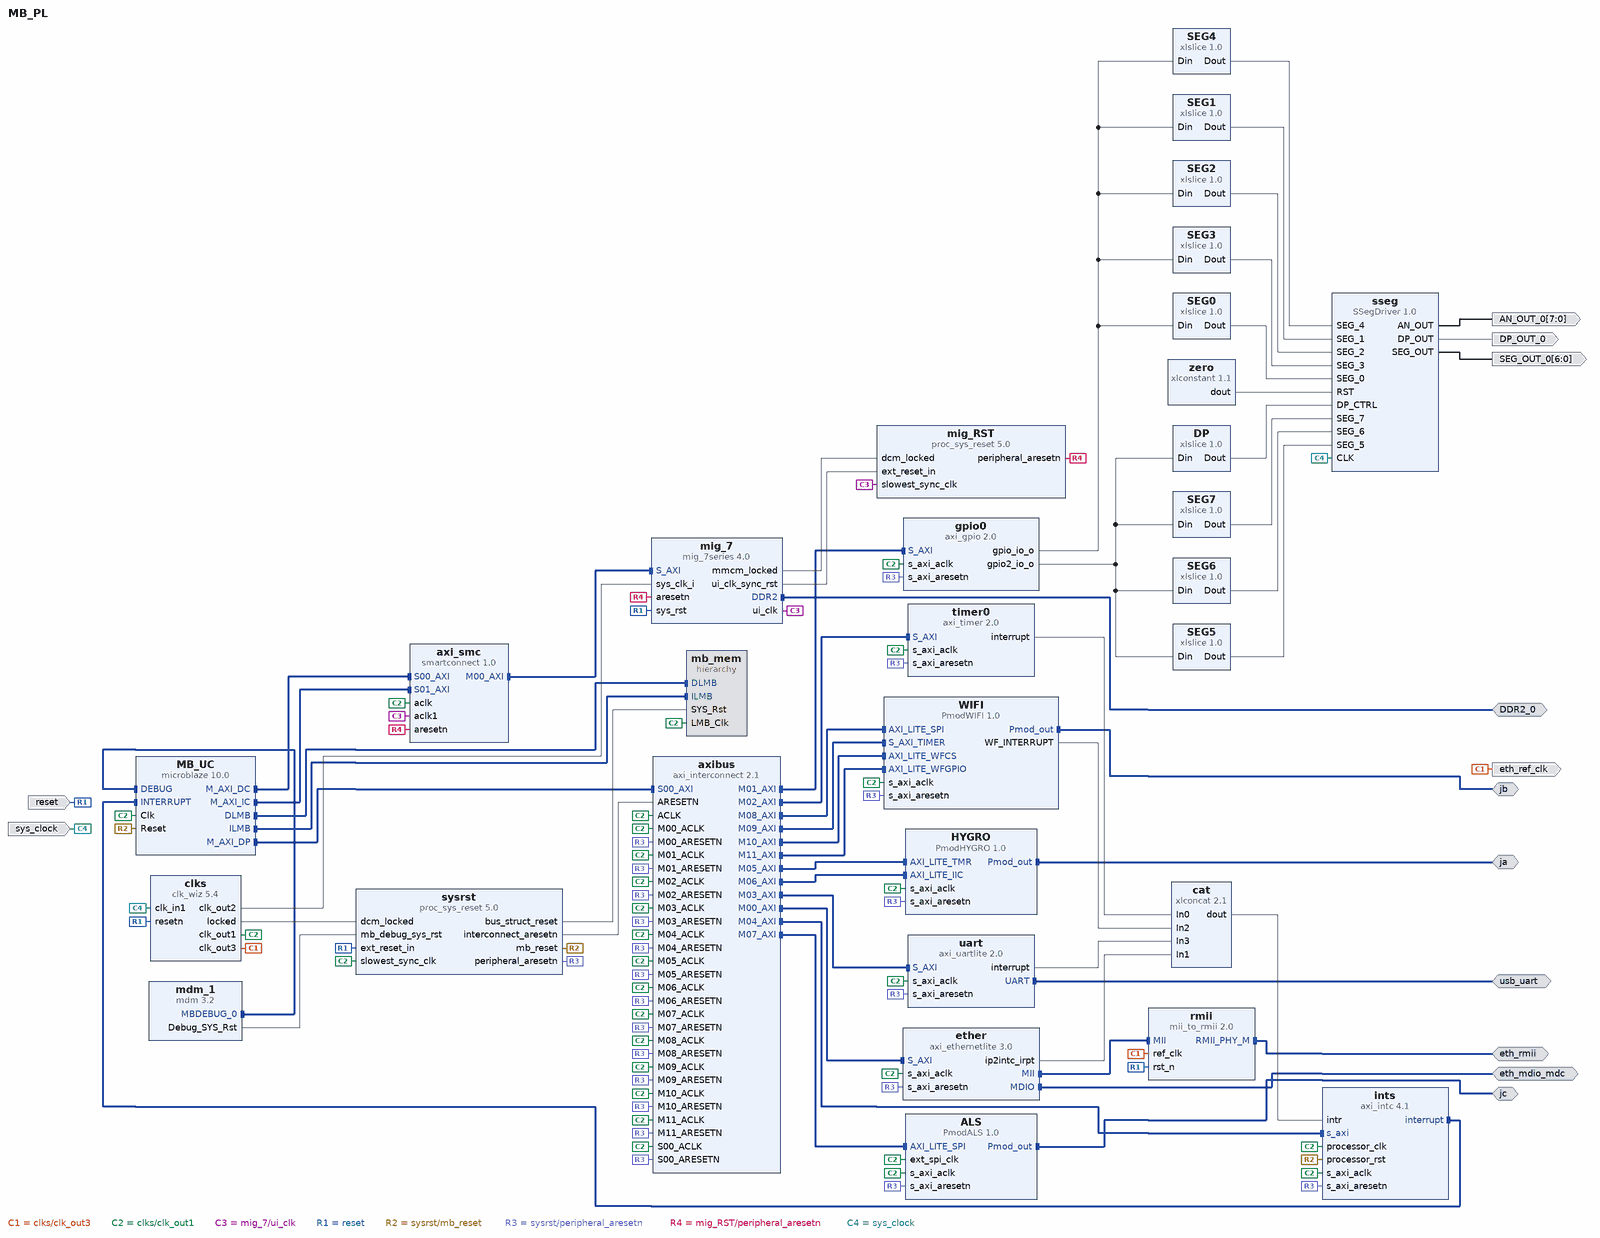
[diagram p0: block diagram of the top level]
# Vivado block design MB_PL, xc7a100tcsg324-1, Vivado 2017.4
create_bd_design MB_PL

create_bd_intf_port -mode Master -vlnv xilinx.com:interface:mdio_rtl:1.0 eth_mdio_mdc
create_bd_intf_port -mode Master -vlnv xilinx.com:interface:rmii_rtl:1.0 eth_rmii
create_bd_intf_port -mode Master -vlnv xilinx.com:interface:uart_rtl:1.0 usb_uart
create_bd_intf_port -mode Master -vlnv xilinx.com:interface:ddrx_rtl:1.0 DDR2_0
create_bd_intf_port -mode Master -vlnv digilentinc.com:interface:pmod_rtl:1.0 ja
create_bd_intf_port -mode Master -vlnv digilentinc.com:interface:pmod_rtl:1.0 jc
create_bd_intf_port -mode Master -vlnv digilentinc.com:interface:pmod_rtl:1.0 jb
create_bd_port -dir O -from 7 -to 0 AN_OUT_0
create_bd_port -dir O DP_OUT_0
create_bd_port -dir O -from 6 -to 0 SEG_OUT_0
create_bd_port -dir O -type clk eth_ref_clk
create_bd_port -dir I -type rst reset
set_property -dict {CONFIG.POLARITY ACTIVE_LOW} [get_bd_ports reset]
create_bd_port -dir I -type clk sys_clock
set_property -dict {CONFIG.FREQ_HZ 100000000 CONFIG.PHASE 0.000} [get_bd_ports sys_clock]

create_bd_cell -type ip -vlnv xilinx.com:ip:xlslice:1.0 DP
set_property -dict {CONFIG.DIN_TO 12 CONFIG.DIN_FROM 19 CONFIG.DIN_WIDTH 20 CONFIG.DOUT_WIDTH 8} [get_bd_cells DP]
create_bd_cell -type ip -vlnv xilinx.com:ip:xlslice:1.0 SEG0
set_property -dict {CONFIG.DIN_TO 0 CONFIG.DIN_FROM 3 CONFIG.DIN_WIDTH 20 CONFIG.DOUT_WIDTH 4} [get_bd_cells SEG0]
create_bd_cell -type ip -vlnv xilinx.com:ip:xlslice:1.0 SEG1
set_property -dict {CONFIG.DIN_TO 4 CONFIG.DIN_FROM 7 CONFIG.DIN_WIDTH 20 CONFIG.DOUT_WIDTH 4} [get_bd_cells SEG1]
create_bd_cell -type ip -vlnv xilinx.com:ip:xlslice:1.0 SEG2
set_property -dict {CONFIG.DIN_TO 8 CONFIG.DIN_FROM 11 CONFIG.DIN_WIDTH 20 CONFIG.DOUT_WIDTH 4} [get_bd_cells SEG2]
create_bd_cell -type ip -vlnv xilinx.com:ip:xlslice:1.0 SEG3
set_property -dict {CONFIG.DIN_TO 12 CONFIG.DIN_FROM 15 CONFIG.DIN_WIDTH 20 CONFIG.DOUT_WIDTH 4} [get_bd_cells SEG3]
create_bd_cell -type ip -vlnv xilinx.com:ip:xlslice:1.0 SEG4
set_property -dict {CONFIG.DIN_TO 16 CONFIG.DIN_FROM 19 CONFIG.DIN_WIDTH 20 CONFIG.DOUT_WIDTH 4} [get_bd_cells SEG4]
create_bd_cell -type ip -vlnv xilinx.com:ip:xlslice:1.0 SEG5
set_property -dict {CONFIG.DIN_TO 0 CONFIG.DIN_FROM 3 CONFIG.DIN_WIDTH 20 CONFIG.DOUT_WIDTH 4} [get_bd_cells SEG5]
create_bd_cell -type ip -vlnv xilinx.com:ip:xlslice:1.0 SEG6
set_property -dict {CONFIG.DIN_TO 4 CONFIG.DIN_FROM 7 CONFIG.DIN_WIDTH 20 CONFIG.DOUT_WIDTH 4} [get_bd_cells SEG6]
create_bd_cell -type ip -vlnv xilinx.com:ip:xlslice:1.0 SEG7
set_property -dict {CONFIG.DIN_TO 8 CONFIG.DIN_FROM 11 CONFIG.DIN_WIDTH 20 CONFIG.DOUT_WIDTH 4} [get_bd_cells SEG7]
create_bd_cell -type ip -vlnv HazyJay:SSeg:SSegDriver:1.0 sseg
create_bd_cell -type ip -vlnv xilinx.com:ip:axi_ethernetlite:3.0 ether
set_property -dict {CONFIG.USE_BOARD_FLOW true CONFIG.MDIO_BOARD_INTERFACE eth_mdio_mdc} [get_bd_cells ether]
create_bd_cell -type ip -vlnv xilinx.com:ip:axi_gpio:2.0 gpio0
set_property -dict [list \
  CONFIG.C_GPIO_WIDTH 20 \
  CONFIG.C_GPIO2_WIDTH 20 \
  CONFIG.C_IS_DUAL 1 \
  CONFIG.USE_BOARD_FLOW true \
  CONFIG.GPIO_BOARD_INTERFACE Custom \
  CONFIG.GPIO2_BOARD_INTERFACE Custom \
  CONFIG.C_ALL_OUTPUTS 1 \
  CONFIG.C_ALL_OUTPUTS_2 1 \
] [get_bd_cells gpio0]
create_bd_cell -type ip -vlnv xilinx.com:ip:smartconnect:1.0 axi_smc
set_property -dict {CONFIG.NUM_SI 2 CONFIG.NUM_CLKS 2} [get_bd_cells axi_smc]
create_bd_cell -type ip -vlnv xilinx.com:ip:axi_timer:2.0 timer0
create_bd_cell -type ip -vlnv xilinx.com:ip:axi_uartlite:2.0 uart
set_property -dict {CONFIG.USE_BOARD_FLOW true CONFIG.UARTLITE_BOARD_INTERFACE usb_uart} [get_bd_cells uart]
create_bd_cell -type ip -vlnv xilinx.com:ip:clk_wiz:5.4 clks
set_property -dict [list \
  CONFIG.CLKOUT2_USED true \
  CONFIG.CLKOUT3_USED true \
  CONFIG.NUM_OUT_CLKS 3 \
  CONFIG.CLKOUT2_REQUESTED_OUT_FREQ 200.000 \
  CONFIG.CLKOUT3_REQUESTED_OUT_FREQ 50.000 \
  CONFIG.PRIM_SOURCE Single_ended_clock_capable_pin \
  CONFIG.RESET_PORT resetn \
  CONFIG.MMCM_DIVCLK_DIVIDE 1 \
  CONFIG.MMCM_CLKOUT1_DIVIDE 5 \
  CONFIG.MMCM_CLKOUT2_DIVIDE 20 \
  CONFIG.RESET_TYPE ACTIVE_LOW \
  CONFIG.USE_BOARD_FLOW true \
  CONFIG.CLK_IN1_BOARD_INTERFACE sys_clock \
  CONFIG.RESET_BOARD_INTERFACE reset \
  CONFIG.CLKOUT2_JITTER 114.829 \
  CONFIG.CLKOUT2_PHASE_ERROR 98.575 \
  CONFIG.CLKOUT3_JITTER 151.636 \
  CONFIG.CLKOUT3_PHASE_ERROR 98.575 \
] [get_bd_cells clks]
create_bd_cell -type ip -vlnv xilinx.com:ip:mdm:3.2 mdm_1
create_bd_cell -type ip -vlnv xilinx.com:ip:microblaze:10.0 MB_UC
set_property -dict [list \
  CONFIG.C_D_AXI 1 \
  CONFIG.C_D_LMB 1 \
  CONFIG.C_I_LMB 1 \
  CONFIG.C_DEBUG_ENABLED 1 \
  CONFIG.C_USE_ICACHE 1 \
  CONFIG.C_CACHE_BYTE_SIZE 16384 \
  CONFIG.C_USE_DCACHE 1 \
  CONFIG.C_DCACHE_BYTE_SIZE 16384 \
] [get_bd_cells MB_UC]
create_bd_cell -type ip -vlnv xilinx.com:ip:axi_intc:4.1 ints
set_property -dict {CONFIG.C_HAS_FAST 1} [get_bd_cells ints]
create_bd_cell -type ip -vlnv xilinx.com:ip:axi_interconnect:2.1 axibus
set_property -dict {CONFIG.NUM_MI 12} [get_bd_cells axibus]
create_bd_cell -type hier mb_mem
create_bd_cell -type ip -vlnv xilinx.com:ip:xlconcat:2.1 cat
set_property -dict {CONFIG.NUM_PORTS 4} [get_bd_cells cat]
create_bd_cell -type ip -vlnv xilinx.com:ip:mii_to_rmii:2.0 rmii
set_property -dict {CONFIG.RESET_BOARD_INTERFACE reset CONFIG.RMII_BOARD_INTERFACE eth_rmii} [get_bd_cells rmii]
create_bd_cell -type ip -vlnv xilinx.com:ip:proc_sys_reset:5.0 sysrst
set_property -dict {CONFIG.USE_BOARD_FLOW true CONFIG.RESET_BOARD_INTERFACE reset} [get_bd_cells sysrst]
create_bd_cell -type ip -vlnv xilinx.com:ip:proc_sys_reset:5.0 mig_RST
create_bd_cell -type ip -vlnv xilinx.com:ip:xlconstant:1.1 zero
set_property -dict {CONFIG.CONST_VAL 0} [get_bd_cells zero]
create_bd_cell -type ip -vlnv xilinx.com:ip:mig_7series:4.0 mig_7
set_property -dict [list \
  CONFIG.XML_INPUT_FILE board.prj \
  CONFIG.RESET_BOARD_INTERFACE Custom \
  CONFIG.MIG_DONT_TOUCH_PARAM Custom \
  CONFIG.BOARD_MIG_PARAM Custom \
] [get_bd_cells mig_7]
create_bd_cell -type ip -vlnv digilentinc.com:IP:PmodHYGRO:1.0 HYGRO
set_property -dict {CONFIG.USE_BOARD_FLOW true CONFIG.PMOD ja} [get_bd_cells HYGRO]
create_bd_cell -type ip -vlnv digilentinc.com:IP:PmodALS:1.0 ALS
set_property -dict {CONFIG.USE_BOARD_FLOW true CONFIG.PMOD jc} [get_bd_cells ALS]
create_bd_cell -type ip -vlnv digilentinc.com:IP:PmodWIFI:1.0 WIFI
set_property -dict {CONFIG.USE_BOARD_FLOW true CONFIG.PMOD jb} [get_bd_cells WIFI]

# ---- hierarchy /mb_mem ----
current_bd_instance /mb_mem
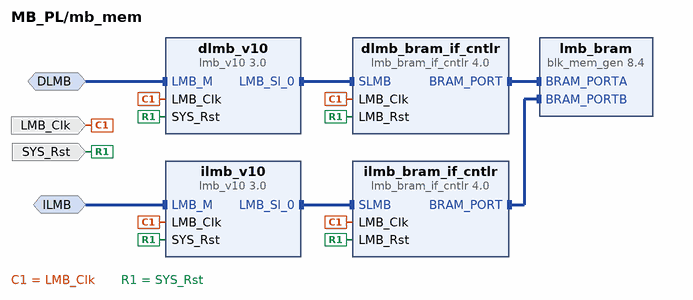
[diagram p1: block diagram inside /mb_mem]
create_bd_intf_pin -mode MirroredMaster -vlnv xilinx.com:interface:lmb_rtl:1.0 DLMB
create_bd_intf_pin -mode MirroredMaster -vlnv xilinx.com:interface:lmb_rtl:1.0 ILMB
create_bd_pin -dir I -type clk LMB_Clk
create_bd_pin -dir I -type rst SYS_Rst

create_bd_cell -type ip -vlnv xilinx.com:ip:lmb_v10:3.0 dlmb_v10
create_bd_cell -type ip -vlnv xilinx.com:ip:lmb_v10:3.0 ilmb_v10
create_bd_cell -type ip -vlnv xilinx.com:ip:lmb_bram_if_cntlr:4.0 dlmb_bram_if_cntlr
set_property -dict {CONFIG.C_ECC 0} [get_bd_cells dlmb_bram_if_cntlr]
create_bd_cell -type ip -vlnv xilinx.com:ip:lmb_bram_if_cntlr:4.0 ilmb_bram_if_cntlr
set_property -dict {CONFIG.C_ECC 0} [get_bd_cells ilmb_bram_if_cntlr]
create_bd_cell -type ip -vlnv xilinx.com:ip:blk_mem_gen:8.4 lmb_bram
set_property -dict {CONFIG.Memory_Type True_Dual_Port_RAM CONFIG.use_bram_block BRAM_Controller} [get_bd_cells lmb_bram]

# ---- connections ----

current_bd_instance /mb_mem
connect_bd_intf_net -intf_net microblaze_0_dlmb_bus [get_bd_intf_pins dlmb_v10/LMB_Sl_0] [get_bd_intf_pins dlmb_bram_if_cntlr/SLMB]
connect_bd_intf_net -intf_net microblaze_0_ilmb_bus [get_bd_intf_pins ilmb_v10/LMB_Sl_0] [get_bd_intf_pins ilmb_bram_if_cntlr/SLMB]
connect_bd_intf_net -intf_net microblaze_0_dlmb_cntlr [get_bd_intf_pins dlmb_bram_if_cntlr/BRAM_PORT] [get_bd_intf_pins lmb_bram/BRAM_PORTA]
connect_bd_intf_net -intf_net microblaze_0_ilmb_cntlr [get_bd_intf_pins ilmb_bram_if_cntlr/BRAM_PORT] [get_bd_intf_pins lmb_bram/BRAM_PORTB]
connect_bd_intf_net -intf_net microblaze_0_dlmb [get_bd_intf_pins DLMB] [get_bd_intf_pins dlmb_v10/LMB_M]
connect_bd_intf_net -intf_net microblaze_0_ilmb [get_bd_intf_pins ILMB] [get_bd_intf_pins ilmb_v10/LMB_M]
connect_bd_net -net microblaze_0_Clk [get_bd_pins LMB_Clk] \
  [get_bd_pins dlmb_v10/LMB_Clk] [get_bd_pins dlmb_bram_if_cntlr/LMB_Clk] [get_bd_pins ilmb_v10/LMB_Clk] \
  [get_bd_pins ilmb_bram_if_cntlr/LMB_Clk]
connect_bd_net [get_bd_pins SYS_Rst] \
  [get_bd_pins dlmb_v10/SYS_Rst] [get_bd_pins dlmb_bram_if_cntlr/LMB_Rst] [get_bd_pins ilmb_v10/SYS_Rst] \
  [get_bd_pins ilmb_bram_if_cntlr/LMB_Rst]

current_bd_instance /
connect_bd_intf_net -intf_net axi_ethernetlite_0_MII [get_bd_intf_pins ether/MII] [get_bd_intf_pins rmii/MII]
connect_bd_intf_net -intf_net microblaze_0_M_AXI_DC [get_bd_intf_pins MB_UC/M_AXI_DC] [get_bd_intf_pins axi_smc/S00_AXI]
connect_bd_intf_net -intf_net microblaze_0_M_AXI_IC [get_bd_intf_pins MB_UC/M_AXI_IC] [get_bd_intf_pins axi_smc/S01_AXI]
connect_bd_intf_net -intf_net microblaze_0_axi_dp [get_bd_intf_pins axibus/S00_AXI] [get_bd_intf_pins MB_UC/M_AXI_DP]
connect_bd_intf_net -intf_net microblaze_0_debug [get_bd_intf_pins mdm_1/MBDEBUG_0] [get_bd_intf_pins MB_UC/DEBUG]
connect_bd_intf_net -intf_net microblaze_0_dlmb_1 [get_bd_intf_pins MB_UC/DLMB] [get_bd_intf_pins mb_mem/DLMB]
connect_bd_intf_net -intf_net microblaze_0_ilmb_1 [get_bd_intf_pins MB_UC/ILMB] [get_bd_intf_pins mb_mem/ILMB]
connect_bd_intf_net -intf_net microblaze_0_interrupt [get_bd_intf_pins ints/interrupt] [get_bd_intf_pins MB_UC/INTERRUPT]
connect_bd_intf_net [get_bd_intf_pins axi_smc/M00_AXI] [get_bd_intf_pins mig_7/S_AXI]
connect_bd_intf_net [get_bd_intf_pins axibus/M00_AXI] [get_bd_intf_pins ether/S_AXI]
connect_bd_intf_net [get_bd_intf_pins axibus/M01_AXI] [get_bd_intf_pins gpio0/S_AXI]
connect_bd_intf_net [get_bd_intf_pins axibus/M02_AXI] [get_bd_intf_pins timer0/S_AXI]
connect_bd_intf_net [get_bd_intf_pins axibus/M03_AXI] [get_bd_intf_pins uart/S_AXI]
connect_bd_intf_net [get_bd_intf_pins axibus/M04_AXI] [get_bd_intf_pins ints/s_axi]
connect_bd_intf_net [get_bd_intf_pins axibus/M05_AXI] [get_bd_intf_pins HYGRO/AXI_LITE_TMR]
connect_bd_intf_net [get_bd_intf_pins axibus/M06_AXI] [get_bd_intf_pins HYGRO/AXI_LITE_IIC]
connect_bd_intf_net [get_bd_intf_pins axibus/M07_AXI] [get_bd_intf_pins ALS/AXI_LITE_SPI]
connect_bd_intf_net [get_bd_intf_pins axibus/M08_AXI] [get_bd_intf_pins WIFI/AXI_LITE_SPI]
connect_bd_intf_net [get_bd_intf_pins axibus/M09_AXI] [get_bd_intf_pins WIFI/S_AXI_TIMER]
connect_bd_intf_net [get_bd_intf_pins axibus/M10_AXI] [get_bd_intf_pins WIFI/AXI_LITE_WFCS]
connect_bd_intf_net [get_bd_intf_pins axibus/M11_AXI] [get_bd_intf_pins WIFI/AXI_LITE_WFGPIO]
connect_bd_intf_net -intf_net axi_ethernetlite_0_MDIO [get_bd_intf_ports eth_mdio_mdc] [get_bd_intf_pins ether/MDIO]
connect_bd_intf_net [get_bd_intf_ports eth_rmii] [get_bd_intf_pins rmii/RMII_PHY_M]
connect_bd_intf_net -intf_net axi_uartlite_0_UART [get_bd_intf_ports usb_uart] [get_bd_intf_pins uart/UART]
connect_bd_intf_net [get_bd_intf_ports DDR2_0] [get_bd_intf_pins mig_7/DDR2]
connect_bd_intf_net -intf_net PmodHYGRO_0_Pmod_out [get_bd_intf_ports ja] [get_bd_intf_pins HYGRO/Pmod_out]
connect_bd_intf_net -intf_net PmodALS_0_Pmod_out [get_bd_intf_ports jc] [get_bd_intf_pins ALS/Pmod_out]
connect_bd_intf_net -intf_net PmodWIFI_0_Pmod_out [get_bd_intf_ports jb] [get_bd_intf_pins WIFI/Pmod_out]
connect_bd_net -net DP_SLICE_Dout [get_bd_pins DP/Dout] [get_bd_pins sseg/DP_CTRL]
connect_bd_net [get_bd_pins gpio0/gpio2_io_o] [get_bd_pins SEG6/Din] [get_bd_pins SEG5/Din] [get_bd_pins SEG7/Din] [get_bd_pins DP/Din]
connect_bd_net -net SEG_SLICE1_Dout [get_bd_pins SEG1/Dout] [get_bd_pins sseg/SEG_1]
connect_bd_net -net SEG_SLICE2_Dout [get_bd_pins SEG2/Dout] [get_bd_pins sseg/SEG_2]
connect_bd_net -net SEG_SLICE3_Dout [get_bd_pins SEG3/Dout] [get_bd_pins sseg/SEG_3]
connect_bd_net -net SEG_SLICE4_Dout [get_bd_pins SEG4/Dout] [get_bd_pins sseg/SEG_4]
connect_bd_net -net SEG_SLICE5_Dout [get_bd_pins SEG5/Dout] [get_bd_pins sseg/SEG_5]
connect_bd_net -net SEG_SLICE6_Dout [get_bd_pins SEG6/Dout] [get_bd_pins sseg/SEG_6]
connect_bd_net -net SEG_SLICE7_Dout [get_bd_pins SEG7/Dout] [get_bd_pins sseg/SEG_7]
connect_bd_net -net SEG_SLICE_Dout [get_bd_pins SEG0/Dout] [get_bd_pins sseg/SEG_0]
connect_bd_net -net SSegDriver_0_AN_OUT [get_bd_pins sseg/AN_OUT] [get_bd_ports AN_OUT_0]
connect_bd_net -net SSegDriver_0_DP_OUT [get_bd_pins sseg/DP_OUT] [get_bd_ports DP_OUT_0]
connect_bd_net -net SSegDriver_0_SEG_OUT [get_bd_pins sseg/SEG_OUT] [get_bd_ports SEG_OUT_0]
connect_bd_net -net axi_ethernetlite_0_ip2intc_irpt [get_bd_pins ether/ip2intc_irpt] [get_bd_pins cat/In1]
connect_bd_net -net axi_gpio_0_gpio_io_o [get_bd_pins gpio0/gpio_io_o] \
  [get_bd_pins SEG0/Din] [get_bd_pins SEG1/Din] [get_bd_pins SEG2/Din] [get_bd_pins SEG3/Din] [get_bd_pins SEG4/Din]
connect_bd_net -net axi_timer_0_interrupt [get_bd_pins timer0/interrupt] [get_bd_pins cat/In0]
connect_bd_net -net axi_uartlite_0_interrupt [get_bd_pins uart/interrupt] [get_bd_pins cat/In3]
connect_bd_net -net clk_wiz_1_clk_out3 [get_bd_pins clks/clk_out3] [get_bd_ports eth_ref_clk] [get_bd_pins rmii/ref_clk]
connect_bd_net -net clk_wiz_1_locked [get_bd_pins clks/locked] [get_bd_pins sysrst/dcm_locked]
connect_bd_net [get_bd_pins mdm_1/Debug_SYS_Rst] [get_bd_pins sysrst/mb_debug_sys_rst]
connect_bd_net -net microblaze_0_Clk [get_bd_pins clks/clk_out1] \
  [get_bd_pins MB_UC/Clk] [get_bd_pins ints/s_axi_aclk] [get_bd_pins sysrst/slowest_sync_clk] [get_bd_pins axi_smc/aclk] \
  [get_bd_pins uart/s_axi_aclk] [get_bd_pins ether/s_axi_aclk] [get_bd_pins timer0/s_axi_aclk] [get_bd_pins gpio0/s_axi_aclk] \
  [get_bd_pins ints/processor_clk] [get_bd_pins HYGRO/s_axi_aclk] [get_bd_pins ALS/s_axi_aclk] [get_bd_pins ALS/ext_spi_clk] \
  [get_bd_pins WIFI/s_axi_aclk] [get_bd_pins axibus/ACLK] [get_bd_pins axibus/S00_ACLK] [get_bd_pins axibus/M00_ACLK] \
  [get_bd_pins mb_mem/LMB_Clk] [get_bd_pins axibus/M01_ACLK] [get_bd_pins axibus/M02_ACLK] [get_bd_pins axibus/M03_ACLK] \
  [get_bd_pins axibus/M04_ACLK] [get_bd_pins axibus/M05_ACLK] [get_bd_pins axibus/M06_ACLK] [get_bd_pins axibus/M07_ACLK] \
  [get_bd_pins axibus/M08_ACLK] [get_bd_pins axibus/M09_ACLK] [get_bd_pins axibus/M10_ACLK] [get_bd_pins axibus/M11_ACLK]
connect_bd_net -net microblaze_0_intr [get_bd_pins cat/dout] [get_bd_pins ints/intr]
connect_bd_net -net mig_7series_0_mmcm_locked [get_bd_pins mig_7/mmcm_locked] [get_bd_pins mig_RST/dcm_locked]
connect_bd_net -net mig_7series_0_ui_clk [get_bd_pins mig_7/ui_clk] [get_bd_pins axi_smc/aclk1] [get_bd_pins mig_RST/slowest_sync_clk]
connect_bd_net -net mig_7series_0_ui_clk_sync_rst [get_bd_pins mig_7/ui_clk_sync_rst] [get_bd_pins mig_RST/ext_reset_in]
connect_bd_net [get_bd_ports reset] [get_bd_pins clks/resetn] [get_bd_pins sysrst/ext_reset_in] [get_bd_pins rmii/rst_n] [get_bd_pins mig_7/sys_rst]
connect_bd_net -net rst_clk_wiz_1_100M_bus_struct_reset [get_bd_pins sysrst/bus_struct_reset] [get_bd_pins mb_mem/SYS_Rst]
connect_bd_net -net rst_clk_wiz_1_100M_interconnect_aresetn [get_bd_pins sysrst/interconnect_aresetn] [get_bd_pins axibus/ARESETN]
connect_bd_net -net rst_clk_wiz_1_100M_mb_reset [get_bd_pins sysrst/mb_reset] [get_bd_pins MB_UC/Reset] [get_bd_pins ints/processor_rst]
connect_bd_net -net rst_clk_wiz_1_100M_peripheral_aresetn [get_bd_pins sysrst/peripheral_aresetn] \
  [get_bd_pins ints/s_axi_aresetn] [get_bd_pins uart/s_axi_aresetn] [get_bd_pins ether/s_axi_aresetn] \
  [get_bd_pins timer0/s_axi_aresetn] [get_bd_pins gpio0/s_axi_aresetn] [get_bd_pins HYGRO/s_axi_aresetn] \
  [get_bd_pins ALS/s_axi_aresetn] [get_bd_pins WIFI/s_axi_aresetn] [get_bd_pins axibus/S00_ARESETN] \
  [get_bd_pins axibus/M00_ARESETN] [get_bd_pins axibus/M01_ARESETN] [get_bd_pins axibus/M02_ARESETN] \
  [get_bd_pins axibus/M03_ARESETN] [get_bd_pins axibus/M04_ARESETN] [get_bd_pins axibus/M05_ARESETN] \
  [get_bd_pins axibus/M06_ARESETN] [get_bd_pins axibus/M07_ARESETN] [get_bd_pins axibus/M08_ARESETN] \
  [get_bd_pins axibus/M09_ARESETN] [get_bd_pins axibus/M10_ARESETN] [get_bd_pins axibus/M11_ARESETN]
connect_bd_net -net rst_mig_7series_0_81M_peripheral_aresetn [get_bd_pins mig_RST/peripheral_aresetn] \
  [get_bd_pins axi_smc/aresetn] [get_bd_pins mig_7/aresetn]
connect_bd_net [get_bd_ports sys_clock] [get_bd_pins clks/clk_in1] [get_bd_pins sseg/CLK]
connect_bd_net -net xlconstant_1_dout [get_bd_pins zero/dout] [get_bd_pins sseg/RST]
connect_bd_net [get_bd_pins clks/clk_out2] [get_bd_pins mig_7/sys_clk_i]
connect_bd_net -net PmodWIFI_0_WF_INTERRUPT [get_bd_pins WIFI/WF_INTERRUPT] [get_bd_pins cat/In2]

# ---- address map ----
assign_bd_address -offset 0x00000000 -range 64K -target_address_space [get_bd_addr_spaces MB_UC/Data] [get_bd_addr_segs mb_mem/dlmb_bram_if_cntlr/SLMB/Mem]
assign_bd_address -offset 0x00010000 -range 64K -target_address_space [get_bd_addr_spaces MB_UC/Data] [get_bd_addr_segs ALS/AXI_LITE_SPI/Reg0]
assign_bd_address -offset 0x40000000 -range 4K -target_address_space [get_bd_addr_spaces MB_UC/Data] [get_bd_addr_segs gpio0/S_AXI/Reg]
assign_bd_address -offset 0x40600000 -range 64K -target_address_space [get_bd_addr_spaces MB_UC/Data] [get_bd_addr_segs uart/S_AXI/Reg]
assign_bd_address -offset 0x40E00000 -range 64K -target_address_space [get_bd_addr_spaces MB_UC/Data] [get_bd_addr_segs ether/S_AXI/Reg]
assign_bd_address -offset 0x41200000 -range 64K -target_address_space [get_bd_addr_spaces MB_UC/Data] [get_bd_addr_segs ints/S_AXI/Reg]
assign_bd_address -offset 0x41C00000 -range 64K -target_address_space [get_bd_addr_spaces MB_UC/Data] [get_bd_addr_segs timer0/S_AXI/Reg]
assign_bd_address -offset 0x44A00000 -range 64K -target_address_space [get_bd_addr_spaces MB_UC/Data] [get_bd_addr_segs HYGRO/AXI_LITE_TMR/Reg0]
assign_bd_address -offset 0x44A10000 -range 64K -target_address_space [get_bd_addr_spaces MB_UC/Data] [get_bd_addr_segs HYGRO/AXI_LITE_IIC/Reg0]
assign_bd_address -offset 0x44A20000 -range 64K -target_address_space [get_bd_addr_spaces MB_UC/Data] [get_bd_addr_segs WIFI/AXI_LITE_SPI/Reg0]
assign_bd_address -offset 0x44A30000 -range 64K -target_address_space [get_bd_addr_spaces MB_UC/Data] [get_bd_addr_segs WIFI/S_AXI_TIMER/Reg0]
assign_bd_address -offset 0x44A40000 -range 64K -target_address_space [get_bd_addr_spaces MB_UC/Data] [get_bd_addr_segs WIFI/AXI_LITE_GPIO_WFCS/Reg0]
assign_bd_address -offset 0x44A50000 -range 64K -target_address_space [get_bd_addr_spaces MB_UC/Data] [get_bd_addr_segs WIFI/AXI_LITE_WFGPIO/Reg0]
assign_bd_address -offset 0x80000000 -range 512M -target_address_space [get_bd_addr_spaces MB_UC/Data] [get_bd_addr_segs mig_7/memmap/memaddr]
assign_bd_address -offset 0x00000000 -range 64K -target_address_space [get_bd_addr_spaces MB_UC/Instruction] [get_bd_addr_segs mb_mem/ilmb_bram_if_cntlr/SLMB/Mem]
assign_bd_address -offset 0x80000000 -range 512M -target_address_space [get_bd_addr_spaces MB_UC/Instruction] [get_bd_addr_segs mig_7/memmap/memaddr]

validate_bd_design
save_bd_design
